# Altium schematic sheet port-expanders.SchDoc
size A3; DocumentNumber: 35; SheetNumber: 35; SheetTotal: 45; SheetDescription: Port Expanders for Digital IOs
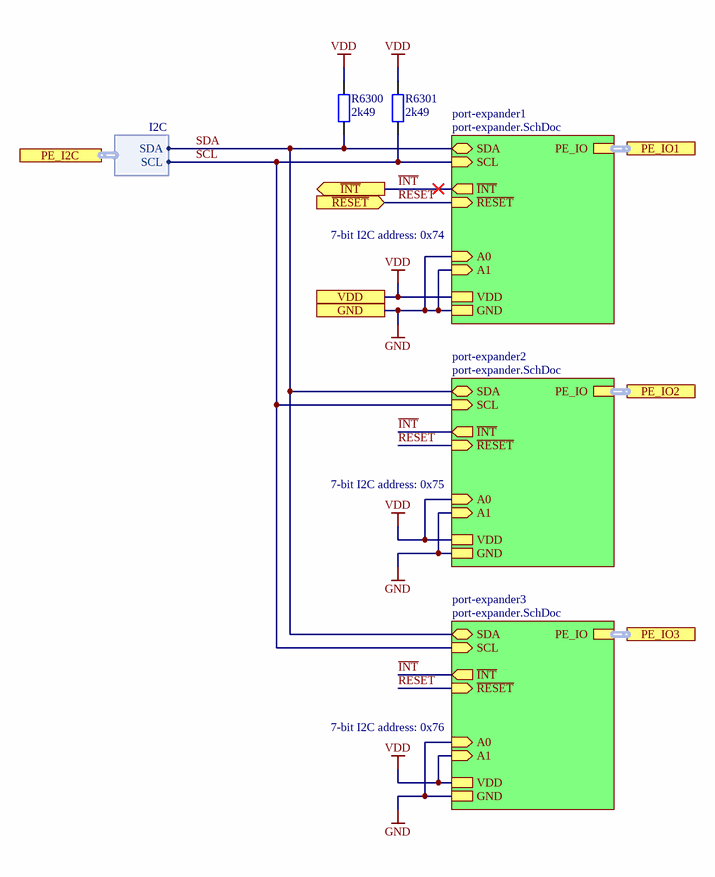
[diagram p0: port-expanders.SchDoc]

## Parts
R6300  2k49  [RESC1005X04N]
R6301  2k49  [RESC1005X04N]

## Sub-sheets
port-expander1 = port-expander.SchDoc: GND, A1 (in), A0 (in), ~{RESET} (in), VDD, SDA (bidir), ~{INT} (out), SCL (in), PE_IO (harness PE_IO)
port-expander2 = port-expander.SchDoc: GND, A1 (in), A0 (in), ~{RESET} (in), VDD, SDA (bidir), ~{INT} (out), SCL (in), PE_IO (harness PE_IO)
port-expander3 = port-expander.SchDoc: GND, A1 (in), A0 (in), ~{RESET} (in), VDD, SDA (bidir), ~{INT} (out), SCL (in), PE_IO (harness PE_IO)

## Ports
GND, PE_I2C (harness I2C), PE_IO1 (harness PE_IO), PE_IO2 (harness PE_IO), PE_IO3 (harness PE_IO), VDD, ~{INT} (out), ~{RESET} (in)

## Harnesses
I2C: SDA, SCL

## Nets
GND: port GND, sheet port-expander1/GND, sheet port-expander1/A1, sheet port-expander1/A0, sheet port-expander2/GND, sheet port-expander2/A1, sheet port-expander3/GND, sheet port-expander3/A0
VDD: R6300.2 R6301.2 ; port VDD, sheet port-expander1/VDD, sheet port-expander2/A0, sheet port-expander2/VDD, sheet port-expander3/A1, sheet port-expander3/VDD
~{INT}: port ~{INT}, sheet port-expander1/~{INT}, sheet port-expander2/~{INT}, sheet port-expander3/~{INT}
~{RESET}: port ~{RESET}, sheet port-expander1/~{RESET}, sheet port-expander2/~{RESET}, sheet port-expander3/~{RESET}
SCL: R6301.1 ; sheet port-expander1/SCL, sheet port-expander2/SCL, sheet port-expander3/SCL, port PE_I2C.SCL
SDA: R6300.1 ; sheet port-expander1/SDA, sheet port-expander2/SDA, sheet port-expander3/SDA, port PE_I2C.SDA

## Buses and harness runs
harness port PE_IO1 = sheet port-expander1/PE_IO
harness port PE_IO2 = sheet port-expander2/PE_IO
harness port PE_IO3 = sheet port-expander3/PE_IO

## Notes on the sheet
- 7-bit I2C address: 0x74
- 7-bit I2C address: 0x75
- 7-bit I2C address: 0x76
- Fraunhofer IISB
- Schottkystr. 10
- developed by:
- 91058 Erlangen
- Germany
- Author
- Project
- License
- Description
- File
- Version
- Release Date
- Sheet
- foxbms.org <https://foxbms.org>
- www.iisb.fraunhofer.de <https://www.iisb.fraunhofer.de/>
- foxBMS Team
- /

## Library data of the parts
R6300 R6301 = gen_R_2k49_0402: SMD Resistor 2k49 0402; Tolerance: 1%; Power: 0.063W; Case EIA: 0402; Case Metric: 1005; Maximum Working Voltage: 50V; PnP Package: 0402R; Automotive Qualified: True; Part Number: gen_R_2k49_0402; Operating Temperature: -55°C - +155°C; Resistance: 2k49; Series: E96; PnP Value: 2k49; Supplier 1: Farnell; Supplier Part Number 1: 2059135